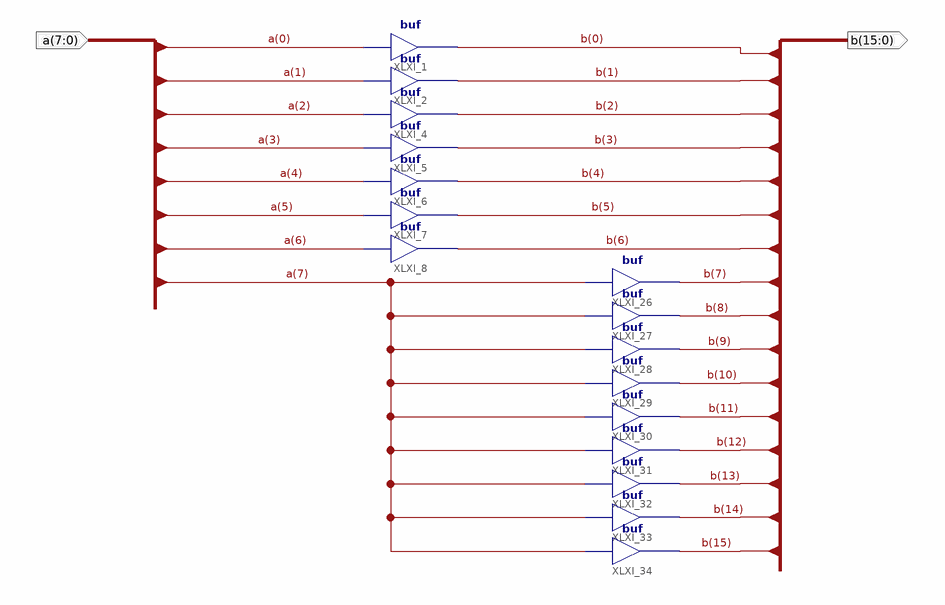
[diagram p0: schematic sheet 1]
// Xilinx ISE schematic Change_8x16.sch (spartan3a) as structural Verilog: 16 symbols, 2 ports
module Change_8x16 (
  input  [7:0] a,
  output [15:0] b
);

  buf XLXI_1 (b[0], a[0]);
  buf XLXI_2 (b[1], a[1]);
  buf XLXI_4 (b[2], a[2]);
  buf XLXI_5 (b[3], a[3]);
  buf XLXI_6 (b[4], a[4]);
  buf XLXI_7 (b[5], a[5]);
  buf XLXI_8 (b[6], a[6]);
  buf XLXI_26 (b[7], a[7]);
  buf XLXI_27 (b[8], a[7]);
  buf XLXI_28 (b[9], a[7]);
  buf XLXI_29 (b[10], a[7]);
  buf XLXI_30 (b[11], a[7]);
  buf XLXI_31 (b[12], a[7]);
  buf XLXI_32 (b[13], a[7]);
  buf XLXI_33 (b[14], a[7]);
  buf XLXI_34 (b[15], a[7]);
endmodule
